# Altium schematic sheet Eval_Board.SchDoc
size A4; SheetNumber: 1; SheetTotal: 1
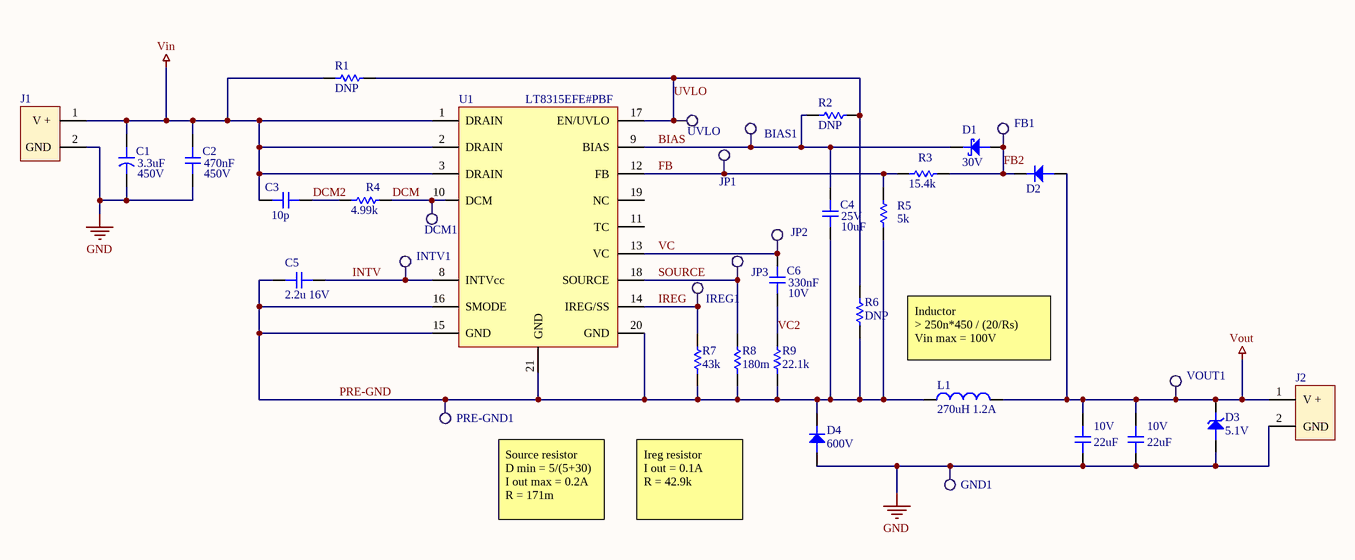
[diagram p0: Eval_Board.SchDoc]

## Parts
BIAS1  Testpoint2  [TP2]  (value not drawn)
C1  Capacitance: 3.3uF  Voltage Rating (DC): 450V  [CAPAE125136X145M]  (hidden comment: 3.3uF 450V)
C2  Capacitance: 470nF  Voltage Rating: 450V  [CAPC4532X28N]  (hidden comment: 0.47uF 450V 1812)
C3  10p  [CAP-0805]
C4  Voltage Rating: 25V  Capacitance: 10uF  [CAP-0805]  (hidden comment: GRM21BR61E106MA73L)
C5  2.2u 16V  [CAP-0805]
C6  Voltage Rating: 10V  Capacitance: 330nF  [CAP-0805]  (hidden comment: 0.33u 10V)
C7  Voltage Rating: 10V  Capacitance: 22uF  [CAP-0805]  (hidden comment: GRM21BR61A226ME51L)
C8  Voltage Rating: 10V  Capacitance: 22uF  [CAP-0805]  (hidden comment: GRM21BR61A226ME51L)
D1  30V  [PMEG3010EGWX]
D2  CMMR1U-06TRPBFREE  [SODFL375X108-2N]  (value not drawn)
D3  5.1V  [SOT95P230X110-3N]
D4  600V  [D3]
DCM1  Testpoint2  [TP2]  (value not drawn)
FB1  Testpoint2  [TP2]  (value not drawn)
GND1  Testpoint2  [TP2]  (value not drawn)
INTV1  Testpoint2  [TP2]  (value not drawn)
IREG1  Testpoint2  [TP2]  (value not drawn)
J1  WM4153-ND  [2PIN]  (value not drawn)
J2  WM4153-ND  [2PIN]  (value not drawn)
JP1  Testpoint2  [TP2]  (value not drawn)
JP2  Testpoint2  [TP2]  (value not drawn)
JP3  Testpoint2  [TP2]  (value not drawn)
L1  270uH 1.2A  [PCBComponent_1]
PRE-GND1  Testpoint2  [TP2]  (value not drawn)
R1  DNP  [RES-0805]
R2  DNP  [RES-0805]
R3  Resistance: 15.4k  [RES-0805]  (hidden comment: RMCF0805FT15K4)
R4  Resistance: 4.99k  [RES-0805]  (hidden comment: RNCP0805FTD4K99)
R5  Resistance: 5k  [RES-0805]  (hidden comment: CRCW08055K00JNTA)
R6  DNP  [RES-0805]
R7  43k  [RESC2012X05N]
R8  180m  [RES-0805]
R9  22.1k  [RESC2012X06N]
U1  LT8315EFE#PBF  [TSOP65P650X120-20N]
UVLO  Testpoint2  [TP2]  (value not drawn)
VOUT1  Testpoint2  [TP2]  (value not drawn)

## Nets
GND: C1.2 C2.2 C7.1 C8.1 D3.2 D4.2 GND1.1 J1.2(GND) J2.2(GND)
Vin: C1.1 C2.1 C3.1 J1.1(V_+) R1.1 U1.1(DRAIN) U1.2(DRAIN) U1.3(DRAIN)
Vout: C7.2 C8.2 D2.2 D3.1 J2.1(V_+) L1.2 VOUT1.1
BIAS: BIAS1.1 C4.2 D1.1 R2.1 U1.9(BIAS)
DCM: DCM1.1 R4.2 U1.10(DCM)
DCM2: C3.2 R4.1
FB: JP1.1 R3.1 R5.2 U1.12(FB)
FB2: D1.2 D2.1 FB1.1 R3.2
INTV: C5.2 INTV1.1 U1.8(INTVcc)
IREG: IREG1.1 R7.2 U1.14(IREG/SS)
PRE-GND: C4.1 C5.1 D4.1 L1.1 PRE-GND1.1 R5.1 R6.2 R7.1 R8.1 R9.1 U1.15(GND) U1.16(SMODE) U1.20(GND) U1.21(GND)
SOURCE: JP3.1 R8.2 U1.18(SOURCE)
UVLO: R1.2 R2.2 R6.1 U1.17(EN/UVLO) UVLO.1
VC: C6.2 JP2.1 U1.13(VC)
VC2: C6.1 R9.2

Not connected (* = marked no-connect by the designer): U1 11(TC) 19(NC)

## Notes on the sheet
- Inductor
  > 250n*450 / (20/Rs)
  Vin max = 100V
- Source resistor
  D min = 5/(5+30)
  I out max = 0.2A
  R = 171m
- Ireg resistor
  I out = 0.1A
  R = 42.9k

## Library data of the parts
BIAS1 DCM1 FB1 GND1 INTV1 IREG1 JP1-JP3 PRE-GND1 UVLO VOUT1 = Testpoint2: Single layer pad TP
C1 = UUJ2W3R3MNQ1MS: Al Cap UJ series SMT 3.3uF 450V; Manufacturer: Nichicon; Tolerance: 20%; Ripple Current: 40mA; Polarity: Polar; Leakage Current: 100uA; Life (Hours): 5000Hour; Lead Diameter: 1.4mm; Supplier 1: Digi-Key; Manufacturer Part Number: UUJ2W3R3MNQ1MS; RoHS: Yes; Category: Aluminum Electrolytic Capacitors; Stock 1: 1639; Pricing 1: 1=1.50000, 10=1.18700, 50=1.02860, 100=0.89010 (USD); Mount: Surface Mount; Case/Package: Radial; Min Operating Temperature: -40°C; Max Operating Temperature: 105°C; Packaging: Tape and Reel; Package Quantity: 500; Voltage Rating: 450V; Termination: SMD/SMT; Voltage: 450V; Series: UJ; Construction: Cylindrical; Diameter: 12.5mm; Length: 13.5mm; Height: 13.5mm; Lead Pitch: 4mm; Height - Seated (Max): 0.571inch; Radiation Hardening: No; RoHS Compliant: Yes; ComponentLink1URL: https://datasheet.ciiva.com/11781/0900766b80fa39e6-11781932.pdf?src-supplier=RSComponents; ComponentLink1Description: https://datasheet.ciiva.com/11781/0900766b80fa39e6-11781932.pdf?src-supplier=RSComponents; ComponentLink2URL: https://datasheet.ciiva.com/11687/e-uj-11687990.pdf?src-supplier=Avnet; ComponentLink2Description: https://datasheet.ciiva.com/11687/e-uj-11687990.pdf?src-supplier=Avnet; Supplier Part Number 1: 493-16089-1-ND
C2 = CGA8N4X7T2W474M230KA: Automotive Grade MLCC, 1812, X7T, 450V, 0.47 F, 20%, 2.30mm; Manufacturer: TDK; Supplier 1: Digi-Key; Manufacturer Part Number: CGA8N4X7T2W474M230KA; RoHS: Yes; Category: Ceramic Capacitors; Stock 1: 1741; Pricing 1: 1=1.20000, 10=0.94400, 50=0.81800, 100=0.70780 (USD); Mount: Surface Mount; Case/Package: 1812; Case Code (Metric): 4532; Case Code (Imperial): 1812; Min Operating Temperature: -55°C; Max Operating Temperature: 125°C; Package Quantity: 500; Packaging: Tape and Reel; Tolerance: 20%; Series: CGA; Length: 0.177inch; Width: 0.126inch; Thickness: 0.098inch; Ratings: AEC-Q200; ComponentLink1URL: https://product.tdk.com/info/en/documents/chara_sheet/CGA8N4X7T2W474M230KA.pdf?src-supplier=Digi-Key; ComponentLink1Description: https://product.tdk.com/info/en/documents/chara_sheet/CGA8N4X7T2W474M230KA.pdf?src-supplier=Digi-Key; ComponentLink2URL: https://product.tdk.com/info/en/catalog/spec/mlccspec_automotive_general_midvoltage_en.pdf?src-supplier=Digi-Key; ComponentLink2Description: https://product.tdk.com/info/en/catalog/spec/mlccspec_automotive_general_midvoltage_en.pdf?src-supplier=Digi-Key; ComponentLink3URL: http://product.tdk.com/en/catalog/datasheets/mlcc_automotive_midvoltage_en.pdf?src-supplier=Avnet; ComponentLink3Description: http://product.tdk.com/en/catalog/datasheets/mlcc_automotive_midvoltage_en.pdf?src-supplier=Avnet; Supplier Part Number 1: 445-13132-1-ND
C3 = GCQ1555C1H9R6DB01D: CAP CER 0805 10PF 25V; Manufacturer: Murata; Supplier 1: Arrow Electronics; Manufacturer Part Number: GCQ1555C1H9R6DB01D; RoHS: Yes; Category: Ceramic Capacitors; Stock 1: 10000; Pricing 1: 1=0.14620, 10=0.10040, 25=0.09950, 100=0.05630, 250=0.05570, 500=0.03880, 1000=0.03350, 3000=0.03160, 6000=0.02890, 10000=0.05540 (USD); Supplier Part Number 1: GCQ1555C1H9R6DB01D
C4 = GRM21BR61E106MA73L: Capacitor, 10 µF, 25 V, 0805 [2012 Metric], ± 20%, X5R, GRM Series; Manufacturer: Murata; Supplier 1: Digi-Key; Manufacturer Part Number: GRM21BR61E106MA73L; RoHS: Yes; Category: Ceramic Capacitors; Stock 1: 357812; Pricing 1: 1=0.26000, 10=0.17900, 50=0.11960, 100=0.10170, 500=0.07176, 1000=0.06279 (USD); Mount: Surface Mount; Case/Package: 0805; Case Code (Metric): 2012; Case Code (Imperial): 0805; Weight: 0.000335oz; Min Operating Temperature: -55°C; Max Operating Temperature: 85°C; Tolerance: 20%; Packaging: Tape and Reel; Dielectric: X5R; Termination: SMD/SMT; Resistor Type: Ceramic; Voltage Rating (DC): 25V; Package Quantity: 3000; Length: 2mm; Width: 0.049inch; Height: 1.25mm; Thickness: 0.055inch; Depth: 1.25mm; REACH SVHC: No SVHC; Lead Free: Lead Free; RoHS Compliant: Yes; ComponentLink1URL: http://www.farnell.com/datasheets/2079185.pdf?src-supplier=Farnell; ComponentLink1Description: http://www.farnell.com/datasheets/2079185.pdf?src-supplier=Farnell; ComponentLink2URL: http://www.mouser.com/ds/2/281/c02e-2905.pdf?src-supplier=Mouser; ComponentLink2Description: http://www.mouser.com/ds/2/281/c02e-2905.pdf?src-supplier=Mouser; ComponentLink3URL: http://components.arrow.com/part/dataview/0323_03061623?src-supplier=Arrow+Europe; ComponentLink3Description: http://components.arrow.com/part/dataview/0323_03061623?src-supplier=Arrow+Europe; ComponentLink4URL: https://search.murata.co.jp/Ceramy/image/img/A01X/G101/ENG/GRM21BR61E106MA73-01.pdf?src-supplier=Digi-Key; ComponentLink4Description: https://search.murata.co.jp/Ceramy/image/img/A01X/G101/ENG/GRM21BR61E106MA73-01.pdf?src-supplier=Digi-Key; ComponentLink5URL: http://www.farnell.com/datasheets/2079185.pdf?src-supplier=Element14; ComponentLink5Description: http://www.farnell.com/datasheets/2079185.pdf?src-supplier=Element14; Supplier Part Number 1: 490-10748-1-ND
C5 = CL21B225KOFNFNE: Cap Ceramic 2.2uF 16V X7R 10% SMD 0805 125C Embossed T/R; Manufacturer: Samsung; Supplier 1: Digi-Key; Manufacturer Part Number: CL21B225KOFNFNE; RoHS: Yes; Category: Ceramic Capacitors; Stock 1: 143505; Pricing 1: 1=0.16000, 10=0.11500, 50=0.06520, 100=0.05400, 500=0.03784, 1000=0.03133 (USD); Mount: Surface Mount; Case/Package: 0805; Case Code (Metric): 2012; Case Code (Imperial): 0805; Contact Plating: Tin; Min Operating Temperature: -55°C; Max Operating Temperature: 125°C; Package Quantity: 1; Packaging: Tape and Reel; Capacitance: 2.2uF; Tolerance: 10%; Voltage Rating: 16V; Dielectric: X7R; Series: CL; Construction: Flat; Length: 0.079inch; Width: 0.049inch; Height: 1.25mm; Thickness: 0.053inch; Depth: 1.25mm; Radiation Hardening: No; RoHS Compliant: Yes; ComponentLink1URL: https://datasheet.ciiva.com/25713/cl21b225kofnfne-25713539.pdf?src-supplier=Digi-Key; ComponentLink1Description: https://datasheet.ciiva.com/25713/cl21b225kofnfne-25713539.pdf?src-supplier=Digi-Key; Supplier Part Number 1: 1276-2956-1-ND
C6 = CGJ4J2X7R1A334K125AA: CAP CER 0.33UF 10V X7R 0805; Manufacturer: TDK; Tolerance: 10%; Ratings: COTS; Supplier 1: Digi-Key; Manufacturer Part Number: CGJ4J2X7R1A334K125AA; RoHS: Yes; Category: Ceramic Capacitors; Stock 1: 991; Pricing 1: 1=0.37000, 10=0.26000, 50=0.18220, 100=0.15610, 500=0.11706, 1000=0.09886 (USD); Mount: Surface Mount; Case/Package: 0805; Case Code (Imperial): 0805; Case Code (Metric): 2012; Weight: 0.000194oz; Min Operating Temperature: -55°C; Max Operating Temperature: 125°C; Packaging: Tape and Reel; Termination: SMD/SMT; Series: CGJ; Voltage Rating (DC): 10V; Package Quantity: 1; Dielectric: X7R; Resistor Type: Ceramic; Length: 2mm; Width: 1.2mm; Height: 1.25mm; Thickness: 0.057inch; Depth: 1.25mm; Radiation Hardening: No; RoHS Compliant: Yes; ComponentLink1URL: https://datasheet.ciiva.com/15192/getdatasheetpartid-715821-15192531.pdf?src-supplier=Verical; ComponentLink1Description: https://datasheet.ciiva.com/15192/getdatasheetpartid-715821-15192531.pdf?src-supplier=Verical; Supplier Part Number 1: 445-8191-1-ND
C7 C8 = GRM21BR61A226ME51L: CAP, MLCC, X5R, 22UF, 10V, 0805; Manufacturer: Murata; Tolerance: 20%; Supplier 1: Digi-Key; Manufacturer Part Number: GRM21BR61A226ME51L; RoHS: Yes; Category: Ceramic Capacitors; Stock 1: 665311; Pricing 1: 1=0.28000, 10=0.19200, 50=0.12800, 100=0.10890, 500=0.07684, 1000=0.06723 (USD); Mount: Surface Mount; Case/Package: 0805; Case Code (Metric): 2012; Case Code (Imperial): 0805; Weight: 0.000335oz; Min Operating Temperature: -55°C; Max Operating Temperature: 85°C; Dielectric: X5R; Packaging: Tape and Reel; Termination: SMD/SMT; Voltage Rating (DC): 10V; Package Quantity: 3000; Length: 2mm; Width: 0.049inch; Height: 1.25mm; Thickness: 0.055inch; Depth: 1.25mm; Radiation Hardening: No; REACH SVHC: No SVHC; Lead Free: Lead Free; RoHS Compliant: Yes; ComponentLink1URL: http://www.farnell.com/datasheets/1955716.pdf?src-supplier=Farnell; ComponentLink1Description: http://www.farnell.com/datasheets/1955716.pdf?src-supplier=Farnell; ComponentLink2URL: http://www.mouser.com/ds/2/281/c02e-2905.pdf?src-supplier=Mouser; ComponentLink2Description: http://www.mouser.com/ds/2/281/c02e-2905.pdf?src-supplier=Mouser; ComponentLink3URL: http://components.arrow.com/part/dataview/0323_06961245?src-supplier=Arrow+Europe; ComponentLink3Description: http://components.arrow.com/part/dataview/0323_06961245?src-supplier=Arrow+Europe; ComponentLink4URL: http://psearch.en.murata.com/capacitor/product/GRM21BR61A226ME51%23.html?src-supplier=Avnet; ComponentLink4Description: http://psearch.en.murata.com/capacitor/product/GRM21BR61A226ME51%23.html?src-supplier=Avnet; ComponentLink5URL: http://search.murata.co.jp/Ceramy/image/img/A01X/G101/ENG/GRM21BR61A226ME51-01.pdf?src-supplier=Digi-Key; ComponentLink5Description: http://search.murata.co.jp/Ceramy/image/img/A01X/G101/ENG/GRM21BR61A226ME51-01.pdf?src-supplier=Digi-Key; ComponentLink6URL: http://www.farnell.com/datasheets/1955716.pdf?src-supplier=Newark; ComponentLink6Description: http://www.farnell.com/datasheets/1955716.pdf?src-supplier=Newark; ComponentLink7URL: http://www.farnell.com/datasheets/1955716.pdf?src-supplier=Element14; ComponentLink7Description: http://www.farnell.com/datasheets/1955716.pdf?src-supplier=Element14; Supplier Part Number 1: 490-10511-1-ND
D1 = PMEG3010EGWX: Manufacturer: Nexperia; Supplier 1: Digi-Key; Manufacturer Part Number: PMEG3010EGWX; RoHS: Yes; Category: Schottky Diodes; Stock 1: 5980; Pricing 1: 1=0.31000, 10=0.25200, 100=0.13360, 500=0.08786, 1000=0.05975 (USD); RoHS Compliant: Yes; Supplier Part Number 1: 1727-7343-1-ND
D2 = CMMR1U-06TRPBFREE: Diode Switching 600V 1A Automotive 2-Pin SOD-123F T/R. https://my.centralsemi.com/datasheets/CMMR1U_SERIES.PDF; Manufacturer: Central Semiconductor; Forward Voltage: 1.7V; Peak Non-Repetitive Surge Current: 30A; Element Configuration: Single; Supplier 1: Digi-Key; Manufacturer Part Number: CMMR1U-06TRPBFREE; RoHS: Yes; Category: Uncategorized; Stock 1: 10653; Pricing 1: 1=0.82000, 10=0.72600, 100=0.55660, 500=0.44000, 1000=0.35200 (USD); Mount: Surface Mount; Case/Package: SOD; Number of Pins: 2; Min Operating Temperature: -65°C; Max Operating Temperature: 150°C; Packaging: Tape and Reel; Radiation Hardening: No; RoHS Compliant: Yes; ComponentLink1URL: https://datasheet.ciiva.com/26939/getdatasheetpartid-707878-26939601.pdf?src-supplier=Verical; ComponentLink1Description: https://datasheet.ciiva.com/26939/getdatasheetpartid-707878-26939601.pdf?src-supplier=Verical; Supplier Part Number 1: 1514-CMMR1U-06TRPBFREECT-ND
D3 = BZX84-C5V1,215: Zener Diode Single 5.1V 5% 60Ohm 250mW Automotive 3-Pin SOT-23 T/R; Manufacturer: Nexperia; Supplier 1: Digi-Key; Manufacturer Part Number: BZX84-C5V1,215; RoHS: Yes; Stock 1: 23070; Pricing 1: 1=0.14000, 10=0.12900, 100=0.07000, 500=0.04308, 1000=0.02937 (USD); RoHS Compliant: Yes; ComponentLink1URL: http://www.farnell.com/datasheets/2242065.pdf?src-supplier=Farnell; ComponentLink1Description: http://www.farnell.com/datasheets/2242065.pdf?src-supplier=Farnell; ComponentLink2URL: https://assets.nexperia.com/documents/data-sheet/BZX84_SER.pdf?src-supplier=Digi-Key; ComponentLink2Description: https://assets.nexperia.com/documents/data-sheet/BZX84_SER.pdf?src-supplier=Digi-Key; Supplier Part Number 1: 1727-2939-1-ND
D4 = HS2JFSM3G: Manufacturer: Taiwan Semiconductor; Supplier 1: DigiKey; Manufacturer Part Number: HS2JFSM3G; RoHS: No; Stock 1: 3460; Pricing 1: 1=0.45000, 10=0.38700, 100=0.28900, 500=0.22704, 1000=0.17544 (USD); Supplier Part Number 1: 1801-HS2JFSM3GCT-ND
J1 J2 = 2PIN: CONN HEADER R/A 2POS 2.54MM; Manufacturer: Molex; Manufacturer Part Number: 0705530106; Number of Positions: 2; Contact Resistance: 30mR; Connector Type: Male Pin; Supplier 1: Digi-Key; Stock 1: 2224; Pricing 1: 1=1.38, 10=1.25, 100=1.071, 500=0.8925, 1000=0.765, 5000=0.6783, 10000=0.663 (USD); Mount: Through Hole; Housing Material: Polyester; Contact Plating: Gold; Contact Material: Bronze; Color: Black; Housing Color: Black; Min Operating Temperature: -40°C; Max Operating Temperature: 105°C; Number of Rows: 1; Packaging: Rail/Tube; Termination: Solder; Number of Contacts: 2; Orientation: Right Angle; Length: 7.37mm; Pitch: 2.54mm; Depth: 13.59mm; Contact Mating Length: 0.24inch; ComponentLink1URL: http://www.molex.com/webdocs/datasheets/pdf/en-us/0705530106_PCB_HEADERS.pdf?src-supplier=Avnet+Asia; ComponentLink1Description: http://www.molex.com/webdocs/datasheets/pdf/en-us/0705530106_PCB_HEADERS.pdf?src-supplier=Avnet+Asia; ComponentLink2URL: https://www.molex.com/pdm_docs/ps/PS-70400.pdf?src-supplier=Digi-Key; ComponentLink2Description: https://www.molex.com/pdm_docs/ps/PS-70400.pdf?src-supplier=Digi-Key; Supplier Part Number 1: WM4153-ND
L1 = SDR1307-271KL: FIXED IND 270UH 1.2A 410 MOHM; Manufacturer: Bourns; Core Material: Ferrite; Saturation Current: 1.8A; Tolerance: 10%; Shielding: Unshielded; Self Resonant Frequency: 3.5MHz; Q Factor: 15; DC Resistance (DCR): 410mR; Test Frequency: 100kHz; Supplier 1: Digi-Key; Manufacturer Part Number: SDR1307-271KL; RoHS: Yes; Category: Fixed Inductors; Stock 1: 932; Pricing 1: 1=1.10000, 10=1.02200, 25=0.94400, 50=0.78640, 100=0.73930 (USD); Mount: Surface Mount; Case/Package: Nonstandard; Min Operating Temperature: -40°C; Max Operating Temperature: 125°C; Package Quantity: 400; Current Rating: 1.2A; Packaging: Tape and Reel; Inductance Tolerance: 10%; Inductance: 270uH; Resistor Type: Wirewound; Max DC Current: 1.2A; Termination: SMD/SMT; DC Current: 1.2A; RMS Current (Irms): 1.2A; Series: SDR1307; Diameter: 13mm; Length: 0.512inch; Width: 0.512inch; Height: 0.276inch; Height - Seated (Max): 0.288inch; Radiation Hardening: No; REACH SVHC: No SVHC; Military Standard: Not; ComponentLink1URL: https://datasheet.ciiva.com/1060/sdr1307-1060134.pdf?src-supplier=Digi-Key; ComponentLink1Description: https://datasheet.ciiva.com/1060/sdr1307-1060134.pdf?src-supplier=Digi-Key; ComponentLink2URL: https://datasheet.ciiva.com/1060/sdr1307-1060135.pdf?src-supplier=Digi-Key; ComponentLink2Description: https://datasheet.ciiva.com/1060/sdr1307-1060135.pdf?src-supplier=Digi-Key; ComponentLink3URL: https://datasheet.ciiva.com/8515/sdr1307-8515135.pdf?src-supplier=Avnet; ComponentLink3Description: https://datasheet.ciiva.com/8515/sdr1307-8515135.pdf?src-supplier=Avnet; ComponentLink4URL: https://datasheet.ciiva.com/6708/sdr1307-6708549.pdf?src-supplier=Digi-Key; ComponentLink4Description: https://datasheet.ciiva.com/6708/sdr1307-6708549.pdf?src-supplier=Digi-Key; ComponentLink5URL: https://datasheet.ciiva.com/22715/1723200-22715551.pdf?src-supplier=Element14; ComponentLink5Description: https://datasheet.ciiva.com/22715/1723200-22715551.pdf?src-supplier=Element14; ComponentLink6URL: https://datasheet.ciiva.com/30244/sdr1307-30244511.pdf?src-supplier=Onlinecomponents.com; ComponentLink6Description: https://datasheet.ciiva.com/30244/sdr1307-30244511.pdf?src-supplier=Onlinecomponents.com; Supplier Part Number 1: SDR1307-271KLCT-ND
R1 = CRCW0805100RFKEA: Res Thick Film 0805 100 Ohm 1% 1/8W ±100ppm/°C Molded SMD Paper T/R; Manufacturer: Vishay Dale; Resistance: 100R; Power Rating: 125mW; Voltage Rating: 150V; Supplier 1: Digi-Key; Manufacturer Part Number: CRCW0805100RFKEA; RoHS: Yes; Category: Chip SMD Resistors; Stock 1: 14649; Pricing 1: 1=0.10000, 10=0.06700, 100=0.02710, 1000=0.01219, 2500=0.01058 (USD); Mount: Surface Mount; Case/Package: 0805; Number of Pins: 2; Contact Plating: Tin; Weight: 0.000194oz; Case Code (Metric): 2012; Case Code (Imperial): 0805; Size Code: 0805; Min Operating Temperature: -55°C; Max Operating Temperature: 155°C; Tolerance: 1%; Resistor Type: Thick Film; Temperature Coefficient: 100ppm/°C; Package Quantity: 10; Packaging: Tape and Reel; Number of Terminations: 2; Termination: SMD/SMT; Max Power Dissipation: 125mW; Voltage Rating (DC): 150V; Features: Automotive AEC-Q200; Series: CRCW; Technology: THICK FILM; Construction: Rectangular; Resistance Tolerance: 1%; Length: 2mm; Width: 0.049inch; Height: 0.45mm; Depth: 1.25mm; Radiation Hardening: No; Lead Free: Lead Free; RoHS Compliant: Yes; REACH SVHC: Unknown; Military Standard: Not; ComponentLink1URL: https://datasheet.ciiva.com/11809/0900766b80d98b26-11809126.pdf?src-supplier=RSComponents; ComponentLink1Description: https://datasheet.ciiva.com/11809/0900766b80d98b26-11809126.pdf?src-supplier=RSComponents; ComponentLink2URL: https://datasheet.ciiva.com/2495/dcrcwe3-2495843.pdf?src-supplier=Digi-Key; ComponentLink2Description: https://datasheet.ciiva.com/2495/dcrcwe3-2495843.pdf?src-supplier=Digi-Key; ComponentLink3URL: https://datasheet.ciiva.com/2495/dcrcwe3-2495844.pdf?src-supplier=Digi-Key; ComponentLink3Description: https://datasheet.ciiva.com/2495/dcrcwe3-2495844.pdf?src-supplier=Digi-Key; ComponentLink4URL: https://datasheet.ciiva.com/5546/dcrcwe3-109170-5546700.pdf?src-supplier=Mouser; ComponentLink4Description: https://datasheet.ciiva.com/5546/dcrcwe3-109170-5546700.pdf?src-supplier=Mouser; ComponentLink5URL: https://datasheet.ciiva.com/3258/dcrcwe3-3258011.pdf?src-supplier=Avnet; ComponentLink5Description: https://datasheet.ciiva.com/3258/dcrcwe3-3258011.pdf?src-supplier=Avnet; ComponentLink6URL: https://datasheet.ciiva.com/8337/dcrcwe3-8337753.pdf?src-supplier=Avnet; ComponentLink6Description: https://datasheet.ciiva.com/8337/dcrcwe3-8337753.pdf?src-supplier=Avnet; ComponentLink7URL: https://datasheet.ciiva.com/2495/dcrcwe3-2495842.pdf?src-supplier=Digi-Key; ComponentLink7Description: https://datasheet.ciiva.com/2495/dcrcwe3-2495842.pdf?src-supplier=Digi-Key; ComponentLink8URL: https://datasheet.ciiva.com/16514/dcrcwe3-16514904.pdf?src-supplier=Avnet+Asia; ComponentLink8Description: https://datasheet.ciiva.com/16514/dcrcwe3-16514904.pdf?src-supplier=Avnet+Asia; ComponentLink9URL: https://datasheet.ciiva.com/15159/getdatasheetpartid-90825-15159895.pdf?src-supplier=Verical; ComponentLink9Description: https://datasheet.ciiva.com/15159/getdatasheetpartid-90825-15159895.pdf?src-supplier=Verical; ComponentLink10URL: https://datasheet.ciiva.com/16760/70201119-16760940.pdf?src-supplier=Allied+Electronics; ComponentLink10Description: https://datasheet.ciiva.com/16760/70201119-16760940.pdf?src-supplier=Allied+Electronics; ComponentLink11URL: https://datasheet.ciiva.com/16777/70201119-16777129.pdf?src-supplier=Allied+Electronics; ComponentLink11Description: https://datasheet.ciiva.com/16777/70201119-16777129.pdf?src-supplier=Allied+Electronics; Supplier Part Number 1: 541-100CCT-ND
R2 = AC0805JR-070RL: Fixed Resistor, Metal Glaze/thick Film, 0.125W, 0ohm, Surface Mount, 0805; Manufacturer: Yageo; Power Rating: 125mW; Tolerance: 5%; Voltage Rating: 150V; Resistance: 0R; Temperature Coefficient: 200ppm/°C; Supplier 1: Digi-Key; Manufacturer Part Number: AC0805JR-070RL; RoHS: Yes; Category: Chip SMD Resistors; Stock 1: 12402; Pricing 1: 1=0.10000, 10=0.03700, 25=0.02680, 50=0.02040, 100=0.01500, 250=0.01148, 500=0.00918, 1000=0.00676 (USD); Case/Package: 0805; Case Code (Imperial): 0805; Case Code (Metric): 2012; Min Operating Temperature: -55°C; Max Operating Temperature: 155°C; Packaging: Tape and Reel; Resistor Type: Thick Film; Termination: SMD/SMT; Number of Terminations: 2; Max Power Dissipation: 125mW; Features: Moisture Resistant,Automotive AEC-Q200; Series: AC; Length: 0.079inch; Width: 1.25mm; Height: 0.024inch; Lead Free: Lead Free; ComponentLink1URL: http://www.yageo.com/NewPortal/yageodocoutput?fileName=/pdf/R-Chip/PYu-AC_51_RoHS_L_6.pdf&src-supplier=Digi-Key; ComponentLink1Description: http://www.yageo.com/NewPortal/yageodocoutput?fileName=/pdf/R-Chip/PYu-AC_51_RoHS_L_6.pdf&src-supplier=Digi-Key; ComponentLink2URL: http://www.yageo.com/documents/recent/PYu-AC_51_RoHS_L_2.pdf?src-supplier=Mouser; ComponentLink2Description: http://www.yageo.com/documents/recent/PYu-AC_51_RoHS_L_2.pdf?src-supplier=Mouser; Supplier Part Number 1: YAG3755CT-ND
R3 = RMCF0805FT15K4: RES 15.4K OHM 1% 1/8W 0805; Manufacturer: Stackpole Electronics; Max Power Dissipation: 125mW; Temperature Coefficient: 100ppm/°C; Supplier 1: Digi-Key; Manufacturer Part Number: RMCF0805FT15K4; RoHS: Yes; Category: Chip SMD Resistors; Stock 1: 4769; Pricing 1: 1=0.10000, 10=0.02700, 100=0.01090, 1000=0.00488, 2500=0.00423 (USD); Mount: Surface Mount; Case/Package: 0805; Case Code (Metric): 2012; Case Code (Imperial): 0805; Contact Plating: Tin,Matte; Min Operating Temperature: -55°C; Max Operating Temperature: 155°C; Tolerance: 1%; Packaging: Tape and Reel; Resistor Type: Thick Film; Number of Terminations: 2; Features: Automotive AEC-Q200; Series: RMCF; Construction: Rectangular; Length: 0.079inch; Width: 0.049inch; Height: 0.026inch; Depth: 1.25mm; Radiation Hardening: No; Military Standard: Not; RoHS Compliant: Yes; ComponentLink1URL: https://datasheet.ciiva.com/26835/getdatasheetpartid-701388-26835687.pdf?src-supplier=Verical; ComponentLink1Description: https://datasheet.ciiva.com/26835/getdatasheetpartid-701388-26835687.pdf?src-supplier=Verical; Supplier Part Number 1: RMCF0805FT15K4CT-ND
R4 = RNCP0805FTD4K99: Res Thin Film 0805 4.99K Ohm 1% 0.25W(1/4W) ±100ppm/°C Sulfur Resistant Pad SMD T/R; Manufacturer: Stackpole Electronics; Max Power Dissipation: 250mW; Supplier 1: Digi-Key; Manufacturer Part Number: RNCP0805FTD4K99; RoHS: Yes; Category: Chip SMD Resistors; Stock 1: 70656; Pricing 1: 1=0.10000, 10=0.07300, 100=0.02970, 1000=0.01336, 2500=0.01159 (USD); Mount: Surface Mount; Case/Package: 0805; Case Code (Metric): 2012; Case Code (Imperial): 0805; Contact Plating: Tin,Matte; Min Operating Temperature: -55°C; Max Operating Temperature: 155°C; Packaging: Tape and Reel; Tolerance: 1%; Resistor Type: Thin Film; Number of Terminations: 2; Temperature Coefficient: 100ppm/°C; Features: Moisture Resistant,Anti-Sulfur; Series: RNCP; Length: 0.079inch; Width: 0.049inch; Height: 0.024inch; Radiation Hardening: No; RoHS Compliant: Yes; ComponentLink1URL: http://www.seielect.com/Catalog/SEI-rncp.pdf?src-supplier=Avnet; ComponentLink1Description: http://www.seielect.com/Catalog/SEI-rncp.pdf?src-supplier=Avnet; ComponentLink2URL: http://www.seielect.com/Catalog/SEI-rncp.pdf?src-supplier=Digi-Key; ComponentLink2Description: http://www.seielect.com/Catalog/SEI-rncp.pdf?src-supplier=Digi-Key; ComponentLink3URL: https://www.seielect.com/catalog/SEI-Packaging.pdf?src-supplier=Digi-Key; ComponentLink3Description: https://www.seielect.com/catalog/SEI-Packaging.pdf?src-supplier=Digi-Key; Supplier Part Number 1: RNCP0805FTD4K99CT-ND
R5 = CRCW08055K00JNTA: Res SMD 5K Ohm 5% 1/8W 0805; Manufacturer: Vishay Dale; Power Rating: 125mW; Voltage Rating: 150V; Temperature Coefficient: 200ppm/°C; Supplier 1: Digi-Key; Manufacturer Part Number: CRCW08055K00JNTA; RoHS: No; Category: Chip SMD Resistors; Stock 1: 3439; Pricing 1: 1=0.14000, 10=0.12100, 100=0.04660, 1000=0.02049, 2500=0.01770 (USD); Case/Package: 0805; Weight: 0.000194oz; Case Code (Imperial): 0805; Case Code (Metric): 2012; Min Operating Temperature: -55°C; Max Operating Temperature: 155°C; Tolerance: 5%; Packaging: Tape and Reel; Package Quantity: 5000; Resistor Type: Thick Film; Number of Terminations: 2; Termination: SMD/SMT; Max Power Dissipation: 125mW; Features: Automotive AEC-Q200; Series: CRCW; Length: 0.079inch; Width: 0.049inch; Height: 0.02inch; Lead Free: Contains Lead; RoHS Compliant: No; ComponentLink1URL: http://www.mouser.com/ds/2/427/dcrcw-72725.pdf?src-supplier=Mouser; ComponentLink1Description: http://www.mouser.com/ds/2/427/dcrcw-72725.pdf?src-supplier=Mouser; ComponentLink2URL: http://www.vishay.com/docs/20008/dcrcw.pdf?src-supplier=Digi-Key; ComponentLink2Description: http://www.vishay.com/docs/20008/dcrcw.pdf?src-supplier=Digi-Key; Supplier Part Number 1: 541-CRCW08055K00JNTACT-ND
R6 = RMCF0805JT1K60: Res Thick Film 0805 1.6K Ohm 5% 1/8W ±100ppm/°C Molded SMD SMD Paper T/R; Manufacturer: Stackpole Electronics; Resistance: 1.6kR; Max Power Dissipation: 125mW; Temperature Coefficient: 200ppm/°C; Supplier 1: Digi-Key; Manufacturer Part Number: RMCF0805JT1K60; RoHS: Yes; Category: Chip SMD Resistors; Stock 1: 7488; Pricing 1: 1=0.10000, 10=0.02000, 100=0.00810, 1000=0.00366, 2500=0.00318 (USD); Mount: Surface Mount; Case/Package: 0805; Case Code (Metric): 2012; Case Code (Imperial): 0805; Contact Plating: Tin,Matte; Min Operating Temperature: -55°C; Max Operating Temperature: 155°C; Tolerance: 5%; Packaging: Tape and Reel; Resistor Type: Thick Film; Number of Terminations: 2; Features: Automotive AEC-Q200; Series: RMCF; Length: 0.079inch; Width: 0.049inch; Height: 0.026inch; Radiation Hardening: No; RoHS Compliant: Yes; ComponentLink1URL: https://www.seielect.com/Catalog/SEI-RMCF_RMCP.pdf?src-supplier=Digi-Key; ComponentLink1Description: https://www.seielect.com/Catalog/SEI-RMCF_RMCP.pdf?src-supplier=Digi-Key; ComponentLink2URL: https://www.seielect.com/catalog/SEI-RMCF_RMCP.pdf?src-supplier=Avnet; ComponentLink2Description: https://www.seielect.com/catalog/SEI-RMCF_RMCP.pdf?src-supplier=Avnet; ComponentLink3URL: http://components.arrow.com/part/dataview/50587586S206405N1174?src-supplier=Arrow+Electronics; ComponentLink3Description: http://components.arrow.com/part/dataview/50587586S206405N1174?src-supplier=Arrow+Electronics; Supplier Part Number 1: RMCF0805JT1K60CT-ND
R7 = CRCW080543K0JNEA: Res Thick Film 0805 43K Ohm 5% 0.125W(1/8W) ±200ppm/C Molded SMD Automotive Paper T/R; Manufacturer: Vishay Dale; Resistance: 43kR; Temperature Coefficient: 200ppm/°C; Max Power Dissipation: 125mW; Voltage Rating: 150V; Supplier 1: Digi-Key; Manufacturer Part Number: CRCW080543K0JNEA; RoHS: Yes; Category: Chip SMD Resistors; Stock 1: 6239; Pricing 1: 1=0.10000, 10=0.05000, 100=0.02040, 1000=0.00914, 2500=0.00794 (USD); Case/Package: 0805; Number of Pins: 2; Weight: 0.000194oz; Case Code (Imperial): 0805; Case Code (Metric): 2012; Contact Plating: Tin; Size Code: 0805; Min Operating Temperature: -55°C; Max Operating Temperature: 155°C; Tolerance: 5%; Packaging: Tape and Reel; Package Quantity: 5000; Resistor Type: Thick Film; Features: Automotive AEC-Q200; Series: CRCW; Number of Terminations: 2; Power Rating: 125mW; Voltage Rating (DC): 150V; Resistance Tolerance: 5%; Construction: Rectangular; Length: 2mm; Width: 1.25mm; Height: 0.45mm; Depth: 1.25mm; Lead Free: Lead Free; RoHS Compliant: Yes; REACH SVHC: Unknown; Military Standard: Not; ComponentLink1URL: https://datasheet.ciiva.com/9008/dcrcwe3-9008904.pdf?src-supplier=Avnet; ComponentLink1Description: https://datasheet.ciiva.com/9008/dcrcwe3-9008904.pdf?src-supplier=Avnet; Supplier Part Number 1: 541-43KACT-ND
R8 = KDV08FR180ET: 0.18 Ohm 0805 1% 0.25W Rohs Compliant: Yes; Manufacturer: Ohmite; Supplier 1: Digi-Key; Manufacturer Part Number: KDV08FR180ET; RoHS: No; Category: Chip SMD Resistors; Stock 1: 15787; Pricing 1: 1=0.29000, 10=0.24200, 25=0.17600, 50=0.12760, 100=0.09460, 250=0.07260, 500=0.05720, 1000=0.03960 (USD); Supplier Part Number 1: 273-KDV08FR180ETCT-ND
R9 = RMCF0805FG22K1: Res Thick Film 0805 22.1K Ohm 1% 1/8W 100ppm/C Molded SMD SMD Paper T/R; Manufacturer: Stackpole Electronics; Resistance: 22.1kR; Max Power Dissipation: 125mW; Temperature Coefficient: 100ppm/°C; Supplier 1: Digi-Key; Manufacturer Part Number: RMCF0805FG22K1; RoHS: Yes; Category: Chip SMD Resistors; Stock 1: 16110; Pricing 1: 1=0.10000, 10=0.02700, 100=0.01090, 1000=0.00488, 2500=0.00423, 5000=0.00350 (USD); Mount: Surface Mount; Case/Package: 0805; Case Code (Metric): 2012; Case Code (Imperial): 0805; Contact Plating: Tin,Matte; Min Operating Temperature: -55°C; Max Operating Temperature: 155°C; Package Quantity: 10000; Packaging: Tape and Reel; Tolerance: 1%; Resistor Type: Thick Film; Number of Terminations: 2; Features: Automotive AEC-Q200; Series: RMCF; Length: 0.079inch; Width: 0.049inch; Height: 0.026inch; Radiation Hardening: No; Lead Free: Lead Free; RoHS Compliant: Yes; ComponentLink1URL: https://www.seielect.com/catalog/SEI-RMCF_RMCP.pdf?src-supplier=Avnet; ComponentLink1Description: https://www.seielect.com/catalog/SEI-RMCF_RMCP.pdf?src-supplier=Avnet; ComponentLink2URL: http://www.seielect.com/Catalog/SEI-RMCF_RMCP.pdf?src-supplier=Digi-Key; ComponentLink2Description: http://www.seielect.com/Catalog/SEI-RMCF_RMCP.pdf?src-supplier=Digi-Key; ComponentLink3URL: https://www.seielect.com/catalog/SEI-Packaging.pdf?src-supplier=Digi-Key; ComponentLink3Description: https://www.seielect.com/catalog/SEI-Packaging.pdf?src-supplier=Digi-Key; ComponentLink4URL: https://www.seielect.com/Catalog/SEI-RMCF_RMCP.pdf?src-supplier=Digi-Key; ComponentLink4Description: https://www.seielect.com/Catalog/SEI-RMCF_RMCP.pdf?src-supplier=Digi-Key; Supplier Part Number 1: RMCF0805FG22K1CT-ND
U1 = LT8315EFE#PBF: IC REG CTRLR FLYBACK 20TSSOP; Manufacturer: Analog Devices / Linear Technology; Supplier 1: Digi-Key; Manufacturer Part Number: LT8315EFE#PBF; RoHS: Yes; Category: Voltage Regulators - Switching; Stock 1: 22; Pricing 1: 1=9.84000, 10=8.88800, 25=8.47480, 100=7.35850, 250=7.02780, 500=6.43500 (USD); RoHS Compliant: Yes; ComponentLink1URL: http://www.linear.com/docs/56703?src-supplier=Digi-Key; ComponentLink1Description: http://www.linear.com/docs/56703?src-supplier=Digi-Key; Supplier Part Number 1: LT8315EFE#PBF-ND